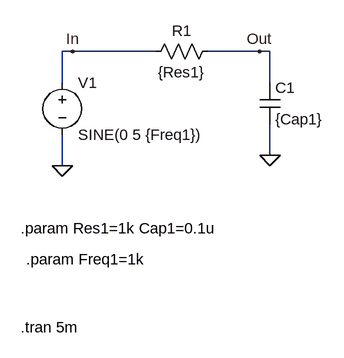
[diagram p0: schematic LPF.asc]
LPF.asc, the LTspice schematic file:
Version 4
SHEET 1 880 680
WIRE -304 16 -320 16
WIRE -176 16 -304 16
WIRE -16 16 -96 16
WIRE 0 16 -16 16
WIRE -320 64 -320 16
WIRE 0 64 0 16
WIRE 0 176 0 128
WIRE -320 192 -320 144
FLAG -320 192 0
FLAG 0 176 0
FLAG -304 16 In
FLAG -16 16 Out
SYMBOL voltage -320 48 R0
WINDOW 123 0 0 Left 0
WINDOW 39 0 0 Left 0
SYMATTR InstName V1
SYMATTR Value SINE(0 5 {Freq1})
SYMBOL res -192 32 R270
WINDOW 0 32 56 VTop 2
WINDOW 3 0 56 VBottom 2
SYMATTR InstName R1
SYMATTR Value {Res1}
SYMBOL cap -16 64 R0
SYMATTR InstName C1
SYMATTR Value {Cap1}
TEXT -384 440 Left 2 !.tran 5m
TEXT -384 288 Left 2 !.param Res1=1k Cap1=0.1u
TEXT -376 336 Left 2 !.param Freq1=1k

The netlist it stands for:
* LPF.asc
V1 In 0 SINE(0 5 {Freq1})
R1 In Out {Res1}
C1 Out 0 {Cap1}
.tran 5m
.param Res1=1k Cap1=0.1u
.param Freq1=1k
.backanno
.end